# EAGLE design h-bridge-gate-driver (EAGLE 7.2.0)
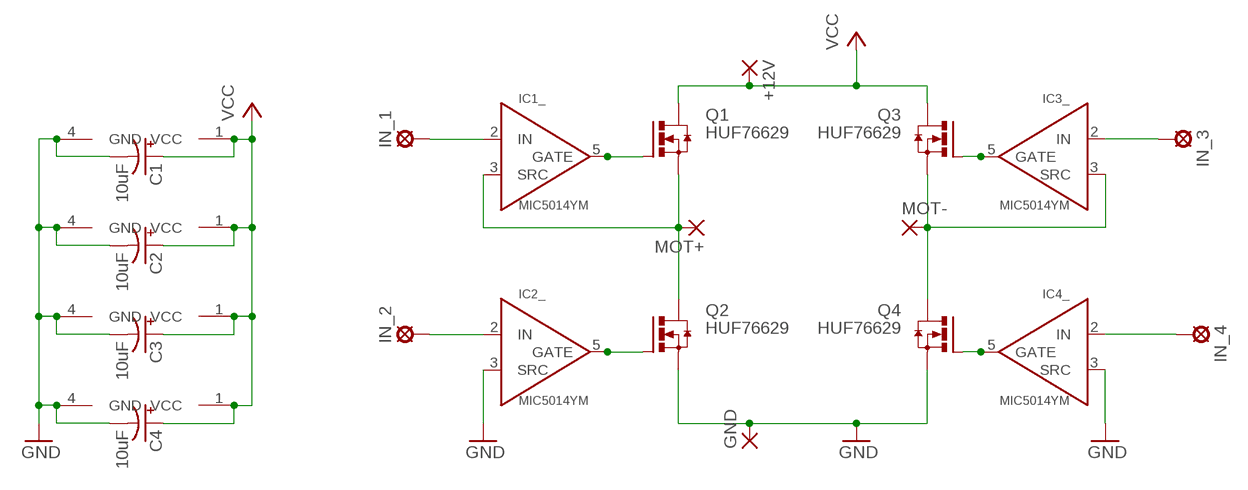
[diagram p0: schematic, sheet 1]

## Parts
+12V  WIREPAD4,16O1,6  [4,16O1,6]
C1  10uF  CPOL-US153CLV-0810  [153CLV-0810]
C2  10uF  CPOL-US153CLV-0810  [153CLV-0810]
C3  10uF  CPOL-US153CLV-0810  [153CLV-0810]
C4  10uF  CPOL-US153CLV-0810  [153CLV-0810]
GND  WIREPAD4,16O1,6  [4,16O1,6]
IC1  MIC5014YM  [SO8]
IC2  MIC5014YM  [SO8]
IC3  MIC5014YM  [SO8]
IC4  MIC5014YM  [SO8]
IN_1  LSP11  [LSP11]
IN_2  LSP11  [LSP11]
IN_3  LSP11  [LSP11]
IN_4  LSP11  [LSP11]
MOT+  WIREPAD4,16O1,6  [4,16O1,6]
MOT-  WIREPAD4,16O1,6  [4,16O1,6]
Q1  HUF76629  HUF76629D3ST_F085D-PAK_TO252  [D-PAK_TO252]
Q2  HUF76629  HUF76629D3ST_F085D-PAK_TO252  [D-PAK_TO252]
Q3  HUF76629  HUF76629D3ST_F085D-PAK_TO252  [D-PAK_TO252]
Q4  HUF76629  HUF76629D3ST_F085D-PAK_TO252  [D-PAK_TO252]

## Nets
GND: C1.- C2.- C3.- C4.- GND.1(P) IC1.4(PWR:GND) IC2.3(_:SRC) IC2.4(PWR:GND) IC3.4(PWR:GND) IC4.3(_:SRC) IC4.4(PWR:GND) Q2.3(S) Q4.3(S)
MOT+: IC1.3(_:SRC) MOT+.1(P) Q1.3(S) Q2.4(D)
MOT-: IC3.3(_:SRC) MOT-.1(P) Q3.3(S) Q4.4(D)
N$1: IC4.2(_:IN) IN_4.MP
N$4: IC3.5(_:GATE) Q3.1(G)
N$6: IC1.2(_:IN) IN_1.MP
N$8: IC3.2(_:IN) IN_3.MP
N$9: IC2.2(_:IN) IN_2.MP
N$15: IC1.5(_:GATE) Q1.1(G)
N$97: IC4.5(_:GATE) Q4.1(G)
N$98: IC2.5(_:GATE) Q2.1(G)
VCC: +12V.1(P) C1.+ C2.+ C3.+ C4.+ IC1.1(PWR:VCC) IC2.1(PWR:VCC) IC3.1(PWR:VCC) IC4.1(PWR:VCC) Q1.4(D) Q3.4(D)

## Library data of the parts
+12V GND MOT+ MOT- = wirepad:WIREPAD: Wire PAD connect wire on PCB
C1-C4 = adafruit:CPOL-US: POLARIZED CAPACITOR, American symbol
IC1-IC4 = nervus:MIC5014: High or low side mosfet driver with integrated charge pump; OC_FARNELL: 1556756
IN_1-IN_4 = solpad:LSP11: SOLDER PAD drill 1.1 mm
Q1-Q4 = nervus:HUF76629D3ST_F085: N-Channel Logic Level UltraFET Power MOSFET 100 V, 20 A, 52 mΩ Datasheet <https://www.fairchildsemi.com/datasheets/HU/HUF76629D3S.pdf>

## Net classes
0 default: width 0.254 mm, clearance 0.254 mm
1 HiCurrent: width 1.905 mm, clearance 0.508 mm

## Board
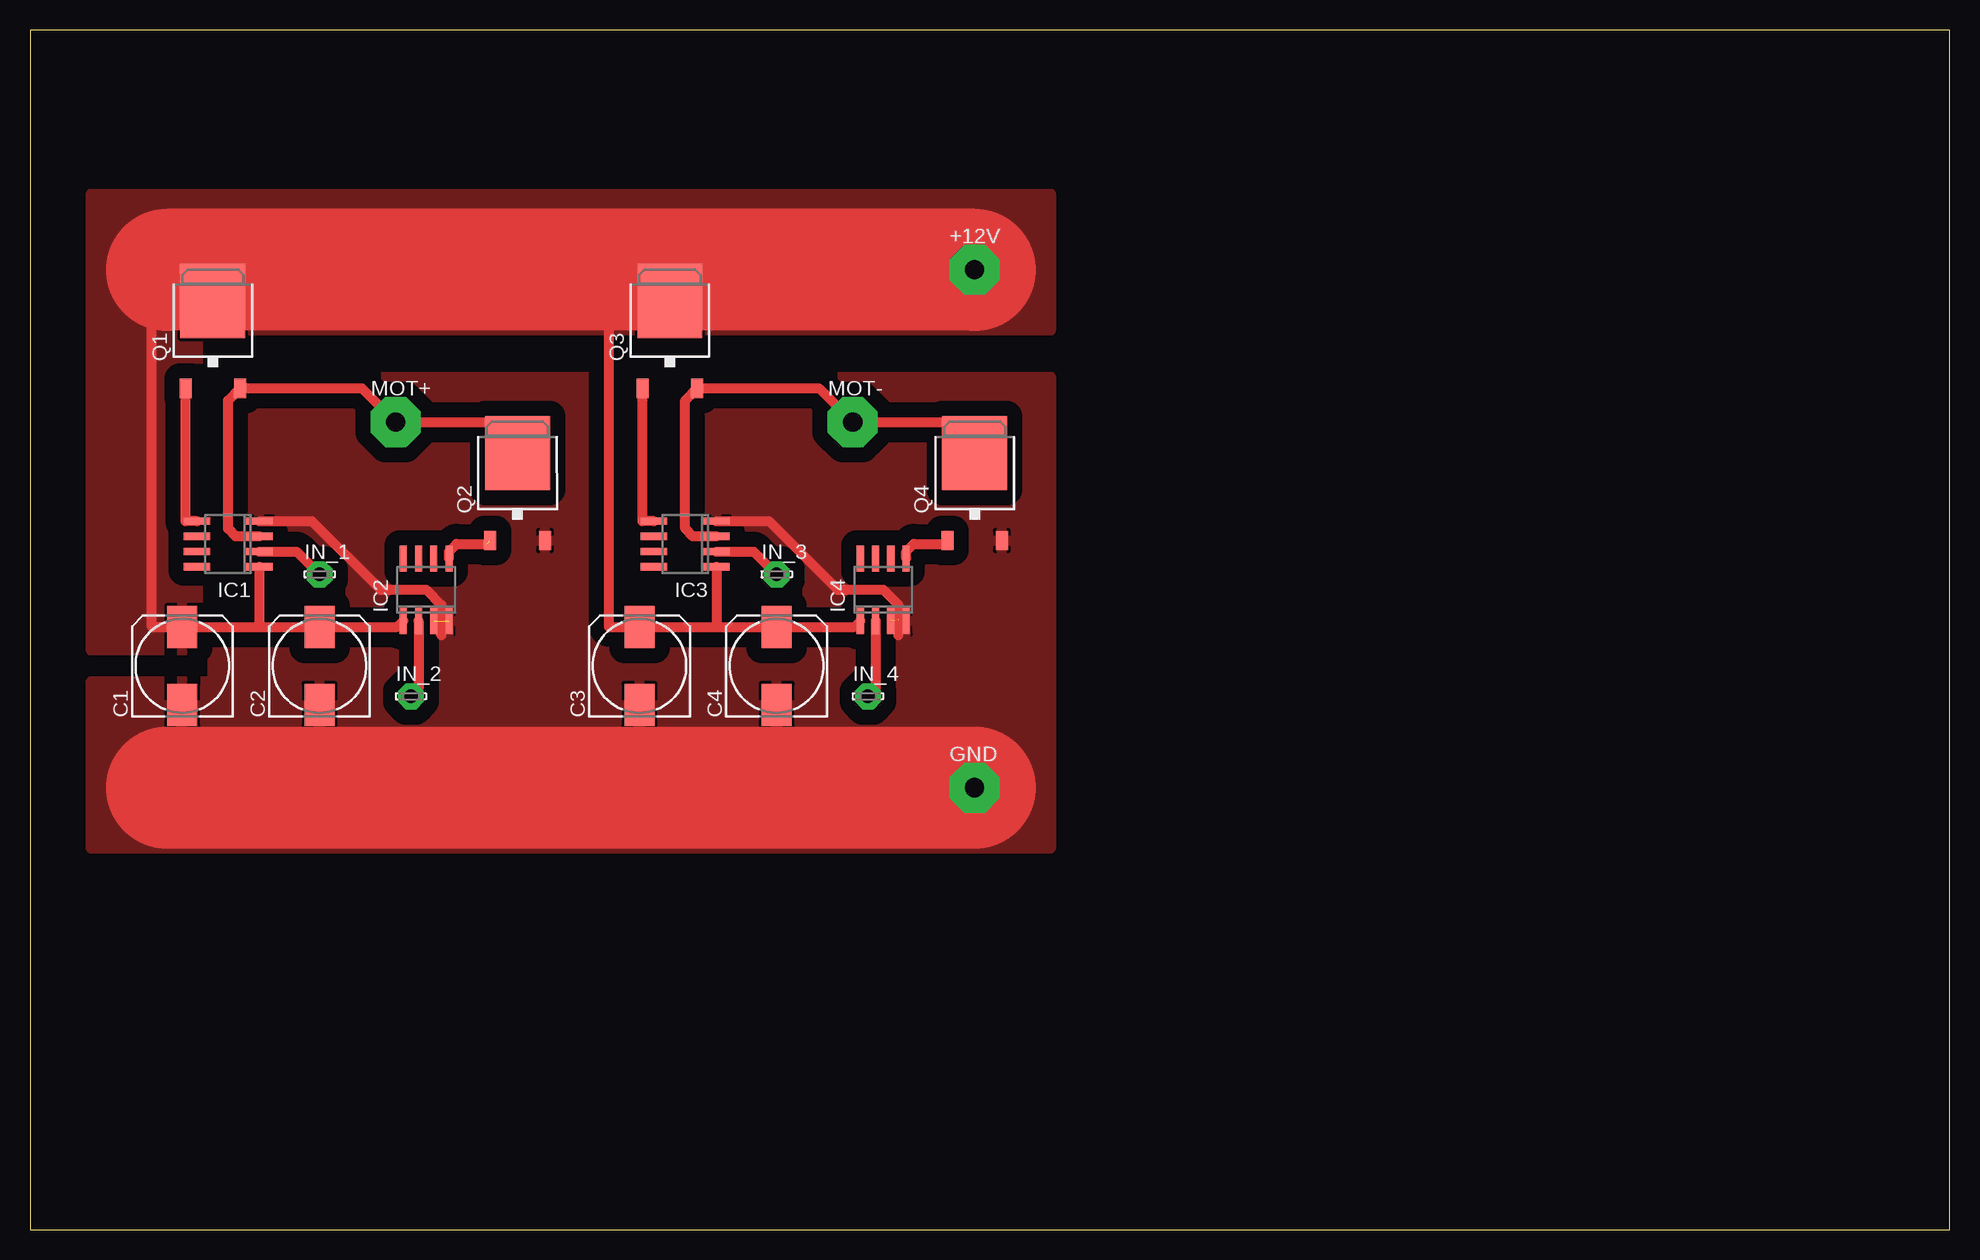
[diagram p1: board, top side]

Size 160 x 100 mm. Coordinates in mm from the lower left corner, seen from the top.
Outline: 0,0 160,0 160,100 0,100 0,0
Copper layers (1*16): Top 0.035mm / dielectric 1.5mm / Bottom 0.035mm
Design rules "default": minimum track width 10mil, minimum drill 24mil, track to track 8mil, track to pad 8mil, pad to pad 8mil, via to via 8mil, smd to smd 8mil, copper to edge 40mil, drill to drill 8mil, minimum pad ring 10mil, minimum via ring 8mil, stop-mask expansion 4mil, vias tented up to drill 0mil, thermal gap 10mil

### Footprints (pad centres in the part's own frame; a part is rotated, then mirrored left to right if it is on the bottom)
4,16O1,6 = drill 1.6 pad 4.166 octagon: 1 0,0
153CLV-0810 = smd 3.5 x 2.5: + 3.25,0; - -3.25,0
SO8 = smd 0.6 x 2.2: 1 -1.905,-2.6; 2 -0.635,-2.6; 3 0.635,-2.6; 4 1.905,-2.6; 5 1.905,2.6; 6 0.635,2.6; 7 -0.635,2.6; 8 -1.905,2.6
LSP11 = drill 1.118 pad 2.159 octagon: MP 0,0
D-PAK_TO252 = smd 1 x 1.6: 1 -2.28,-4.8; 3 2.28,-4.8 | smd 5.4 x 6.2: 4 0,2.5

### Placement (x,y rotation side)
+12V  78.74,80.01 0 top
C1  12.7,46.99 90 top
C2  24.13,46.99 90 top
C3  50.8,46.99 90 top
C4  62.23,46.99 90 top
GND  78.74,36.83 0 top
IC1  16.51,57.15 90 top
IC2  33.02,53.34 0 top
IC3  54.61,57.15 90 top
IC4  71.12,53.34 0 top
IN_1  24.13,54.61 0 top
IN_2  31.75,44.45 0 top
IN_3  62.23,54.61 0 top
IN_4  69.85,44.45 0 top
MOT+  30.48,67.31 0 top
MOT-  68.58,67.31 0 top
Q1  15.24,74.93 0 top
Q2  40.64,62.23 0 top
Q3  53.34,74.93 0 top
Q4  78.74,62.23 0 top

### Tracks (layer width: path | path; a pad name or v marks a point on that pad's centre or on a via)
GND  (2 unrouted)
  Top 0.813: IC1.4 23.5,59.05 29.21,53.34 33.02,53.34 34.29,52.07 34.29,49.53 | IC3.4 61.59,59.05 67.31,53.34 71.12,53.34 72.39,52.07 72.39,50.8 72.39,49.53
  Top 10.16: GND.1 11.43,36.83
  pour Top (isolate 1.27): 15.24,71.12 85.09,71.12 85.09,31.75 5.08,31.75 5.08,45.72 15.24,45.72
MOT+
  Top 0.813: IC1.3 17.14,57.78 16.51,58.42 16.51,69.12 Q1.3 27.66,70.13 MOT+.1 39.37,67.31 40.64,66.04 | Q2.4 40.64,66.04 | 40.64,66.04 40.64,67.31
MOT-
  Top 0.813: IC3.3 55.24,57.78 54.61,58.42 54.61,69.12 Q3.3 65.76,70.13 MOT-.1 76.16,67.31 Q4.4
N$1
  Top 0.813: IC4.2 70.48,45.09 IN_4.MP
N$4
  Top 0.813: IC3.5 51.06,59.05 Q3.1
N$6
  Top 0.813: IC1.2 22.23,56.52 IN_1.MP
N$8
  Top 0.813: IC3.2 60.33,56.52 IN_3.MP
N$9
  Top 0.813: IC2.2 32.38,45.09 IN_2.MP
N$15
  Top 0.813: IC1.5 12.96,59.05 Q1.1
N$97
  Top 0.813: IC4.5 73.03,56.52 73.66,57.15 76.18,57.15 Q4.1
N$98  (1 unrouted)
  Top 0.813: IC2.5 34.92,56.52 35.56,57.15 38.08,57.15
VCC
  Top 0.813: Q1.4 15.2,77.47 10.16,77.47 10.16,50.24 C1.+ 19.05,50.24 | Q3.4 53.3,77.47 48.26,77.47 48.26,50.24 C3.+ 57.15,50.24 | 19.05,50.24 C2.+ 30.61,50.24 IC2.1 | IC1.1 19.11,50.3 19.05,50.24 | 57.15,50.24 C4.+ 68.72,50.24 IC4.1 | IC3.1 57.21,50.3 57.15,50.24
  Top 10.16: +12V.1 11.43,80.01
  pour Top (isolate 1.27): 5.08,86.36 85.09,86.36 85.09,74.93 13.97,74.93 13.97,48.26 5.08,48.26